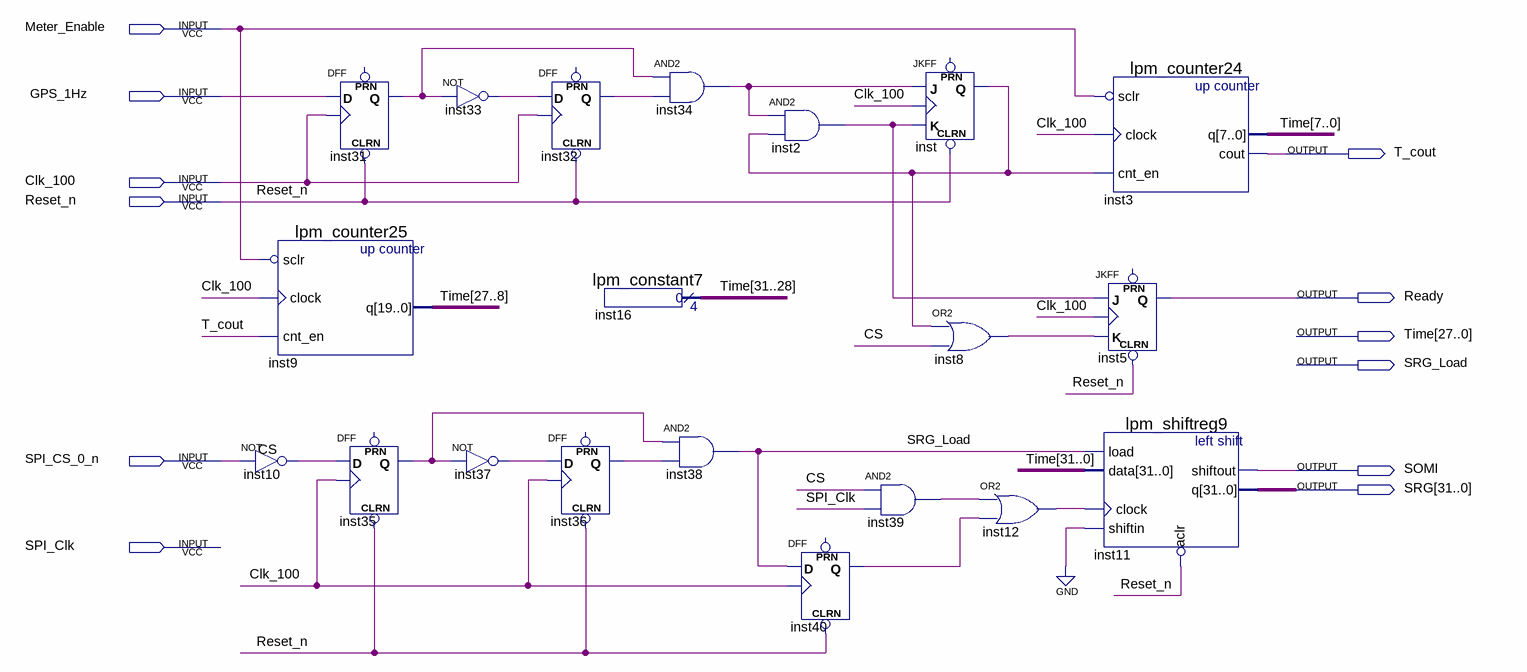
[diagram p0: schematic sheet]
// Quartus schematic Period_Meter.bdf as structural Verilog: 20 symbols, 12 pins
module Period_Meter (
  input  Meter_Enable,
  input  GPS_1Hz,
  input  Clk_100,
  input  Reset_n,
  input  SPI_CS_0_n,
  input  SPI_Clk,
  output T_cout,
  output Ready,
  output [31:0] Time,
  output SRG_Load,
  output SOMI,
  output [31:0] SRG
);

  wire CS, inst2_out, inst8_out, inst12_out, inst31_q, inst32_q, inst33_out, inst34_out, inst35_q, inst36_q,
       inst37_out, inst39_out, inst40_q, inst_q;

  lpm_counter25 inst9 (.sclr(~Meter_Enable), .clock(Clk_100), .cnt_en(T_cout), .q(Time[27:8]));
  not inst10 (CS, SPI_CS_0_n);
  DFF inst31 (.CLRN(Reset_n), .CLK(Clk_100), .D(GPS_1Hz), .Q(inst31_q));  // open: PRN
  DFF inst35 (.CLRN(Reset_n), .CLK(Clk_100), .D(CS), .Q(inst35_q));  // open: PRN
  not inst33 (inst33_out, inst31_q);
  not inst37 (inst37_out, inst35_q);
  DFF inst32 (.CLRN(Reset_n), .CLK(Clk_100), .D(inst33_out), .Q(inst32_q));  // open: PRN
  lpm_constant7 inst16 (.result(Time[31:28]));
  DFF inst36 (.CLRN(Reset_n), .CLK(Clk_100), .D(inst37_out), .Q(inst36_q));  // open: PRN
  and inst34 (inst34_out, inst31_q, inst32_q);
  and inst38 (SRG_Load, inst35_q, inst36_q);
  and inst2 (inst2_out, inst34_out, inst_q);
  DFF inst40 (.CLRN(Reset_n), .CLK(Clk_100), .D(SRG_Load), .Q(inst40_q));  // open: PRN
  and inst39 (inst39_out, CS, SPI_Clk);
  JKFF inst (.CLRN(Reset_n), .K(inst2_out), .J(inst34_out), .CLK(Clk_100), .Q(inst_q));  // open: PRN
  or inst8 (inst8_out, inst_q, CS);
  or inst12 (inst12_out, inst39_out, inst40_q);
  lpm_counter24 inst3 (.sclr(~Meter_Enable), .clock(Clk_100), .cnt_en(inst_q), .q(Time[7:0]), .cout(T_cout));
  JKFF inst5 (.CLRN(Reset_n), .K(inst8_out), .J(inst2_out), .CLK(Clk_100), .Q(Ready));  // open: PRN
  lpm_shiftreg9 inst11 (
    .load(SRG_Load), .data(Time), .clock(inst12_out), .shiftin(1'b0), .aclr(~Reset_n), .shiftout(SOMI),
    .q(SRG));
endmodule
